# Altium schematic sheet DTC_NPN.SchDoc: =DocumentName
size A4; CompanyName: "AS Manufacturing" LLC; Organization: "AS Manufacturing" LLC; Address1: 5 Sklyarenka St.; Address2: Kyiv 04073; Address3: Ukraine; Address4: https://ajax.systems/en/; SheetNumber: 8; SheetTotal: 10; Template_version: 1.0.1
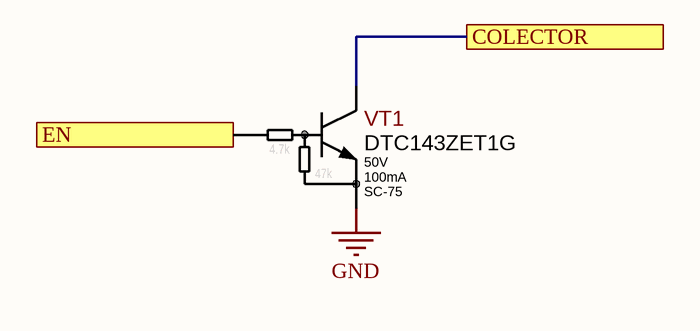
[diagram p0: DTC_NPN.SchDoc]

## Parts
VT1  Vce: 50V  Ic: 100mA  Package: SC-75  [SOT-416]  (hidden comment: DTC143ZET1G)

## Ports
COLECTOR, EN (in)

## Nets
GND: VT1.2(E)
COLECTOR: VT1.3(C) ; port COLECTOR
EN: VT1.1(B) ; port EN

## Notes on the sheet
- Title
- Product:
- Project:
- Size:
- Date:
- Variant:
- A4
- Authors:
- Time:
- Sheet
- of
- Revision:
- @Vitech_ua
- Commit:
- (in symbol DTC143ZET1G) 4.7k; 47k

## Library data of the parts
VT1 = DTC143ZET1G: 50V, 100mA Low Vce(sat) NPN Digital Transistor, Pre-Biased 4.7k/47k (with built-in resistors); Manufacturer: Onsemi; Ajax_1C_ID: 9410; Ajax_1C_PN: DTC143ZET1G SC-75-3  биполярный NPN транзистор; Ajax_1С_Status: Mass Production; Component Status: Released; Standard Lead Time: 8 Weeks; Replacement: NONE; GUID_1C: d76ac5d5-de69-11e6-829b-d8cb8a9acc66; Part Number: DTC143ZET1G; Part Type: NPN; Component Type: SMD; Temperature Range: -55°C ~ 150 °C; ComponentLink1URL: http://www.onsemi.com/pub/Collateral/DTC143Z-D.PDF; Supplier 1: Digi-Key; Supplier Part Number 1: DTC143ZET1GOSTR-ND; Price: 0,0125; ComponentLink1Description: Datasheet